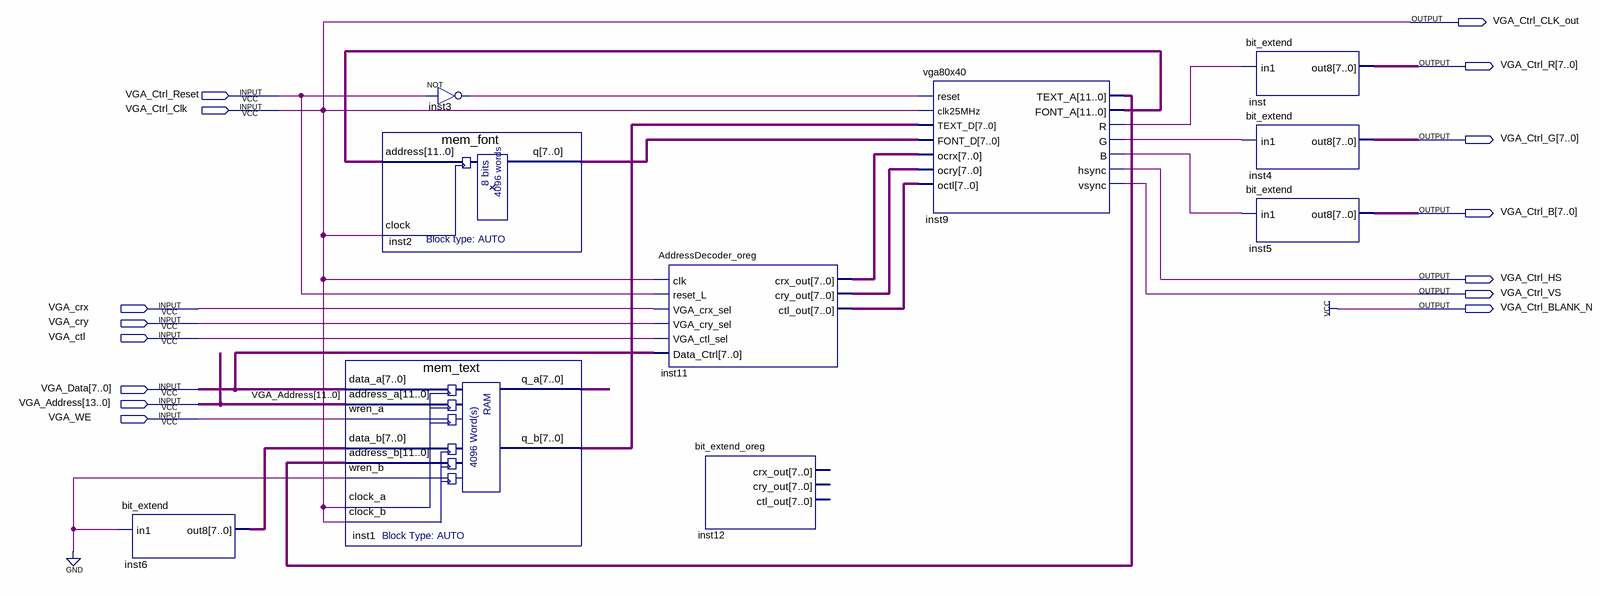
[diagram p0: schematic sheet]
// Quartus schematic VGA_Controller80x40.bdf as structural Verilog: 10 symbols, 15 pins
module VGA_Controller80x40 (
  input  VGA_Ctrl_Reset,
  input  VGA_Ctrl_Clk,
  input  VGA_crx,
  input  VGA_cry,
  input  VGA_ctl,
  input  [7:0] VGA_Data,
  input  [13:0] VGA_Address,
  input  VGA_WE,
  output VGA_Ctrl_CLK_out,
  output [7:0] VGA_Ctrl_R,
  output [7:0] VGA_Ctrl_G,
  output [7:0] VGA_Ctrl_B,
  output VGA_Ctrl_HS,
  output VGA_Ctrl_VS,
  output VGA_Ctrl_BLANK_N
);

  wire inst3_out, inst9_b, inst9_g, inst9_r;
  wire [7:0] inst1_q_a, inst1_q_b, inst2_q, inst6_out8, inst11_crx_out, inst11_cry_out, inst11_ctl_out;
  wire [11:0] inst9_font_a, inst9_text_a;

  bit_extend inst6 (.in1(1'b0), .out8(inst6_out8));
  mem_text inst1 (
    .data_a(VGA_Data), .address_a(VGA_Address[11:0]), .wren_a(VGA_WE), .data_b(inst6_out8),
    .address_b(inst9_text_a), .wren_b(1'b0), .clock_a(VGA_Ctrl_Clk), .clock_b(VGA_Ctrl_Clk), .q_a(inst1_q_a),
    .q_b(inst1_q_b));
  mem_font inst2 (.address(inst9_font_a), .clock(VGA_Ctrl_Clk), .q(inst2_q));
  not inst3 (inst3_out, VGA_Ctrl_Reset);
  AddressDecoder_oreg inst11 (
    .clk(VGA_Ctrl_Clk), .reset_L(VGA_Ctrl_Reset), .VGA_crx_sel(VGA_crx), .VGA_cry_sel(VGA_cry),
    .VGA_ctl_sel(VGA_ctl), .Data_Ctrl(VGA_Data), .crx_out(inst11_crx_out), .cry_out(inst11_cry_out),
    .ctl_out(inst11_ctl_out));
  bit_extend_oreg inst12 ();  // open: crx_out, cry_out, ctl_out
  vga80x40 inst9 (
    .reset(inst3_out), .clk25MHz(VGA_Ctrl_Clk), .TEXT_D(inst1_q_b), .FONT_D(inst2_q), .ocrx(inst11_crx_out),
    .ocry(inst11_cry_out), .octl(inst11_ctl_out), .TEXT_A(inst9_text_a), .FONT_A(inst9_font_a), .R(inst9_r),
    .G(inst9_g), .B(inst9_b), .hsync(VGA_Ctrl_HS), .vsync(VGA_Ctrl_VS));
  bit_extend inst (.in1(inst9_r), .out8(VGA_Ctrl_R));
  bit_extend inst4 (.in1(inst9_g), .out8(VGA_Ctrl_G));
  bit_extend inst5 (.in1(inst9_b), .out8(VGA_Ctrl_B));

  assign VGA_Ctrl_BLANK_N = 1'b1;
  assign VGA_Ctrl_CLK_out = VGA_Ctrl_Clk;
endmodule
